# EAGLE design Stabilized-power-supply (EAGLE 7.6.0)
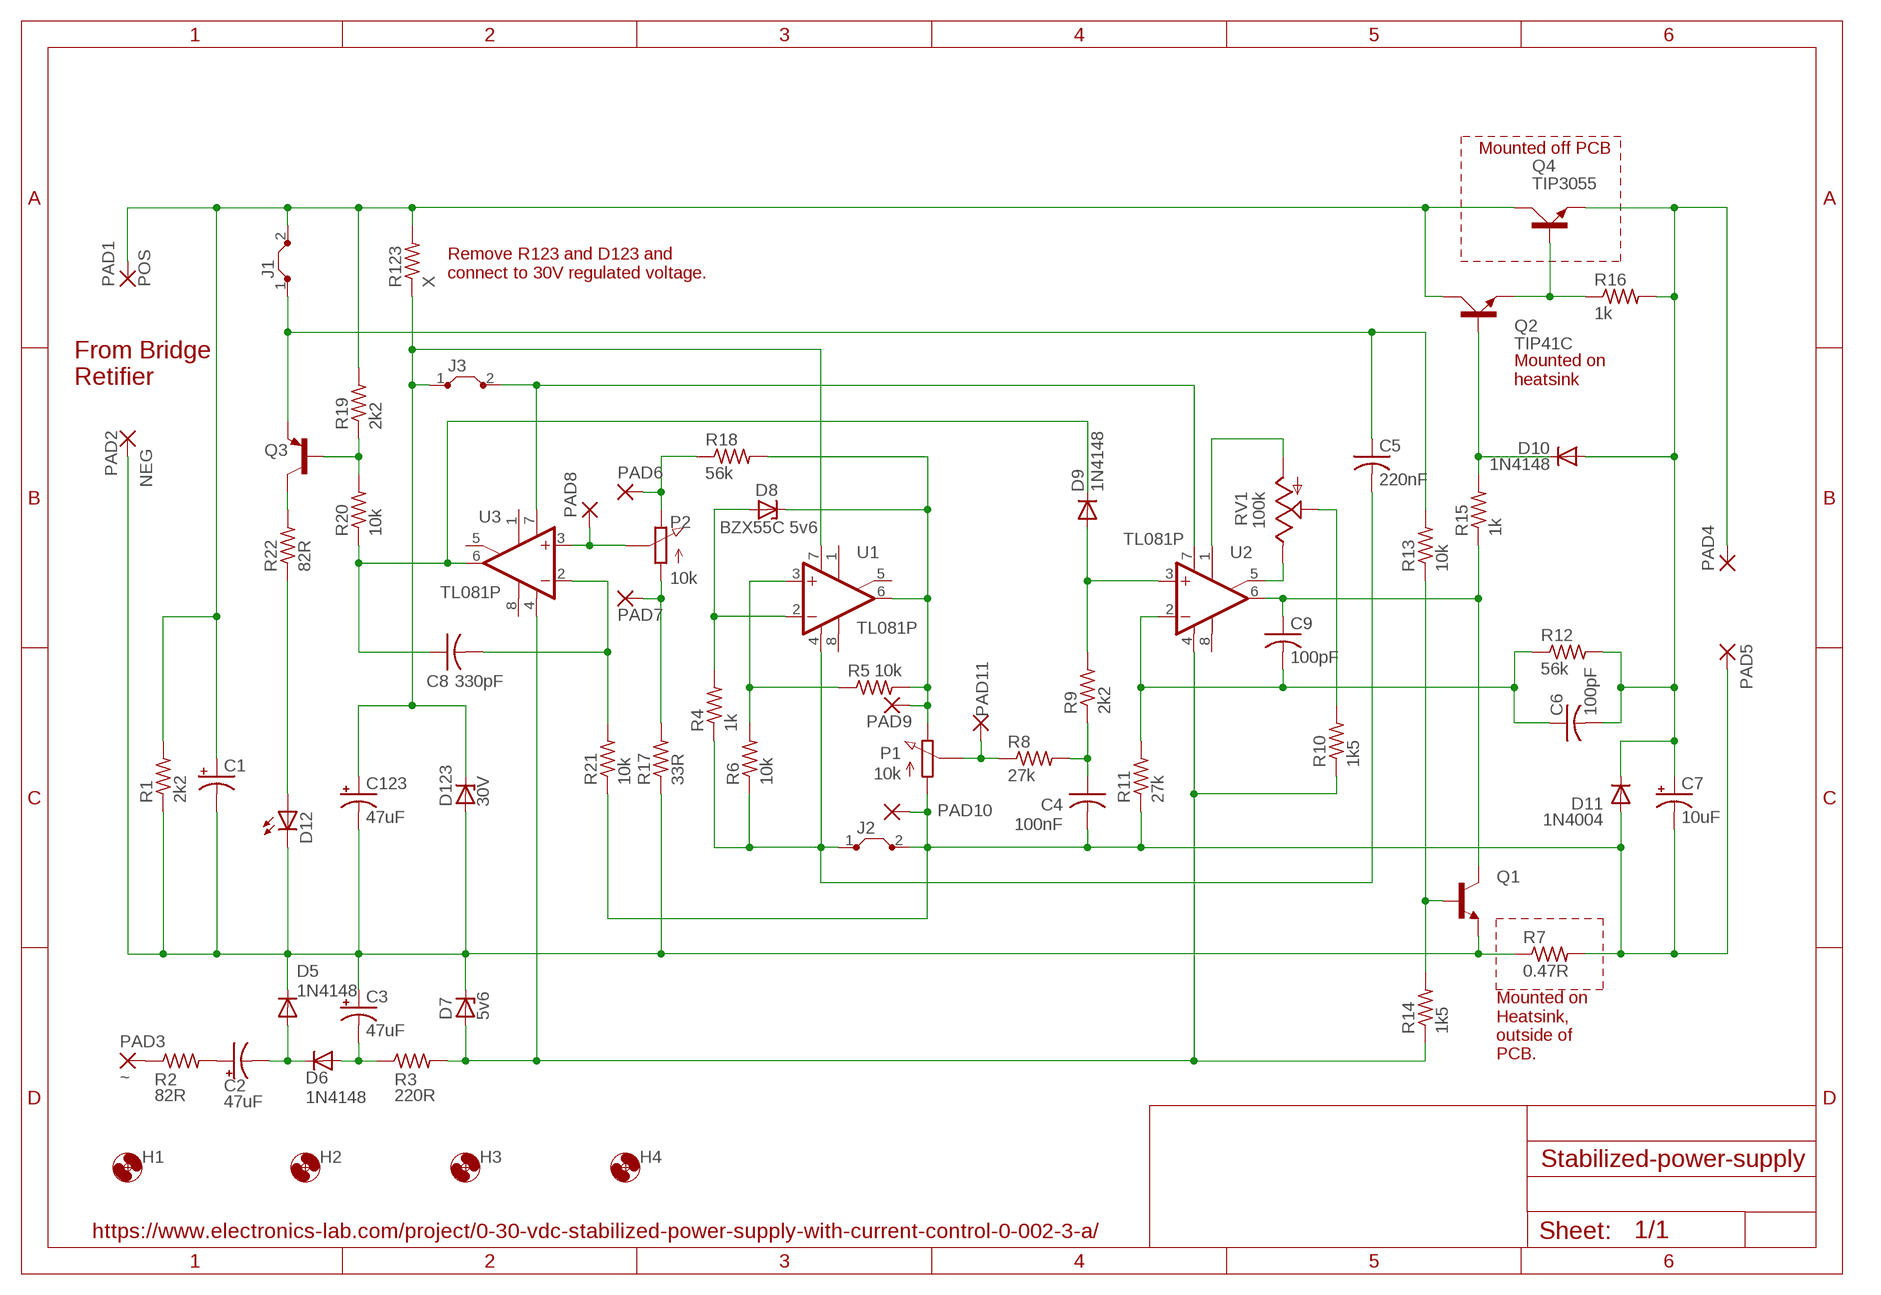
[diagram p0: schematic, sheet 1]

## Parts
C1  CPOL-USE5-10.5  [E5-10,5]
C2  47uF  CPOL-USE2.5-7  [E2,5-7]
C3  47uF  CPOL-USE2.5-7  [E2,5-7]
C4  100nF  C-US075-032X103  [C075-032X103]
C5  220nF  C-US075-032X103  [C075-032X103]
C6  100pF  C-US050-024X044  [C050-024X044]
C7  10uF  CPOL-USE2.5-7  [E2,5-7]
C8  330pF  C-US050-024X044  [C050-024X044]
C9  100pF  C-US050-024X044  [C050-024X044]
C123  47uF  CPOL-USE2.5-7  [E2,5-7]
D5  1N4148  DIODE-D-5  [D-5]
D6  1N4148  DIODE-D-5  [D-5]
D7  5v6  ZENER-DIODEZD-7.5  [ZDIO-7.5]
D8  BZX55C 5v6  ZENER-DIODEZD-7.5  [ZDIO-7.5]
D9  1N4148  DIODE-D-5  [D-5]
D10  1N4148  DIODE-D-5  [D-5]
D11  1N4004  [DO41-10]
D12  LED5MM  [LED5MM]
D123  30V  ZENER-DIODEZD-7.5  [ZDIO-7.5]
H1  MOUNT-HOLE2.8  [2,8]
H2  MOUNT-HOLE2.8  [2,8]
H3  MOUNT-HOLE2.8  [2,8]
H4  MOUNT-HOLE2.8  [2,8]
J1  J7MM  [07]
J2  J7MM  [07]
J3  J7MM  [07]
P1  10k  POT_EXTERNAL  (no package)
P2  10k  POT_EXTERNAL  (no package)
PAD1  POS  3,81/1,4  [3,81/1,4]
PAD2  NEG  3,81/1,4  [3,81/1,4]
PAD3  ~  3,81/1,4  [3,81/1,4]
PAD4  3,81/1,4  [3,81/1,4]
PAD5  3,81/1,4  [3,81/1,4]
PAD6  2,15/1,0  [2,15/1,0]
PAD7  2,15/1,0  [2,15/1,0]
PAD8  2,15/1,0  [2,15/1,0]
PAD9  2,15/1,0  [2,15/1,0]
PAD10  2,15/1,0  [2,15/1,0]
PAD11  2,15/1,0  [2,15/1,0]
Q1  -NPN-TO92-CBE  [TO92-CBE]
Q2  TIP41C  BD139  [TO126AV]
Q3  -PNP-TO92-CBE  [TO92-CBE]
Q4  TIP3055  [TOP3AV]
R1  2k2  R-US_0411/15  [0411/15]
R2  82R  R-US_0207/10  [0207/10]
R3  220R  R-US_0207/10  [0207/10]
R4  1k  R-US_0207/10  [0207/10]
R5  10k  R-US_0207/10  [0207/10]
R6  10k  R-US_0207/10  [0207/10]
R7  0.47R  R-US_0617/22  [0617/22]
R8  27k  R-US_0207/10  [0207/10]
R9  2k2  R-US_0207/10  [0207/10]
R10  1k5  R-US_0207/10  [0207/10]
R11  27k  R-US_0207/10  [0207/10]
R12  56k  R-US_0207/10  [0207/10]
R13  10k  R-US_0207/10  [0207/10]
R14  1k5  R-US_0207/10  [0207/10]
R15  1k  R-US_0207/10  [0207/10]
R16  1k  R-US_0207/10  [0207/10]
R17  33R  R-US_0207/10  [0207/10]
R18  56k  R-US_0207/10  [0207/10]
R19  2k2  R-US_0207/10  [0207/10]
R20  10k  R-US_0207/10  [0207/10]
R21  10k  R-US_0207/10  [0207/10]
R22  82R  R-US_0207/10  [0207/10]
R123  X  R-US_0207/10  [0207/10]
RV1  100k  TRIM_US-ECP10P  [ECP10P]
U1  TL081P  [DIL08]
U2  TL081P  [DIL08]
U3  TL081P  [DIL08]

## Nets
N$1: Q3.C R22.2
N$2: C1.+ J1.2 PAD1.1(P) Q2.C Q4.C R1.2 R19.2 R123.2
N$3: Q3.B R19.1 R20.2
N$4: C8.1 D9.C R20.1 U3.6(OUT)
N$5: P2.S PAD8.1(P) U3.3(+IN)
N$6: P2.E PAD6.1(P) R18.1
N$7: D12.A R22.1
N$8: C123.+ D123.C J3.1 R123.1 U1.7(V+)
N$9: C1.- C3.+ C123.- D5.C D7.C D12.K(C) D123.A PAD2.1(P) Q1.E R1.1 R7.1 R17.1
N$10: C6.2 C7.+ D10.A D11.C PAD4.1(P) Q4.E R12.2 R16.2
N$11: D7.A R3.2 R10.1 R14.1 U2.4(V-) U3.4(V-)
N$12: C8.2 R21.2 U3.2(-IN)
N$13: D8.A R4.2 U1.2(-IN)
N$14: R5.1 R6.2 U1.3(+IN)
N$15: P2.A PAD7.1(P) R17.2
N$16: C4.2 C7.- D11.A J2.2 P1.A PAD5.1(P) PAD10.1(P) R7.2 R11.1 R21.1
N$17: Q1.B R13.1 R14.2
N$18: D8.C P1.E PAD9.1(P) R5.2 R18.2 U1.6(OUT)
N$19: C5.1 J1.1 Q3.E R13.2
N$20: P1.S PAD11.1(P) R8.1
N$21: C4.1 R8.2 R9.1
N$22: D9.A R9.2 U2.3(+IN)
N$23: C6.1 C9.2 R11.2 R12.1 U2.2(-IN)
N$24: D10.C Q2.B R15.2
N$25: C9.1 Q1.C R15.1 U2.6(OUT)
N$26: RV1.A U2.1(ON1)
N$27: RV1.E U2.5(ON2)
N$28: R10.2 RV1.S
N$29: Q2.E Q4.B R16.1
N$30: C3.- D6.A R3.1
N$31: J3.2 U2.7(V+) U3.7(V+)
N$32: C5.2 J2.1 R4.1 R6.1 U1.4(V-)
N$33: C2.- D5.A D6.C
N$34: C2.+ R2.2
N$35: PAD3.1(P) R2.1
Unconnected: U1.1(ON1) U1.5(ON2) U1.8(OPT) U2.8(OPT) U3.1(ON1) U3.5(ON2) U3.8(OPT)

## Notes on the sheet
- Mounted off PCB
- Remove R123 and D123 and
  connect to 30V regulated voltage.
- From Bridge
  Retifier
- Mounted on
  heatsink
- Mounted on
  Heatsink,
  outside of
  PCB.
- https://www.electronics-lab.com/project/0-30-vdc-stabilized-power-supply-with-current-control-0-002-3-a/

## Library data of the parts
C1-C3 C7 C123 = rcl:CPOL-US: POLARIZED CAPACITOR, American symbol
C4-C6 C8 C9 = rcl:C-US: CAPACITOR, American symbol
D5 D6 D9 D10 = diode:DIODE-: DIODE
D7 D8 D123 = diode:ZENER-DIODE: Z-Diode
D11 = diode:1N4004: DIODE general purpose rectifier, 1 A
D12 = led:LED: LED OSRAM: - CHIPLED LG R971, LG N971, LY N971, LG Q971, LY Q971, LO R971, LY R971 LH N974, LH R974 LS Q976, LO Q976, LY Q976 LO Q996 - Hyper CHIPLED LW Q18S LB Q993, LB Q99A, LB R99A - SideLED LS A670, LO A670, LY A670, LG A670, LP A670 LB A673, LV A673, LT A673, LW A673 LH A674 LY A675 LS A676, LA A676, LO A676, LY A676, LW A676 LS A679, LY A679, LG A679 - Hyper Micro SIDELED® LS Y876, LA Y876, LO Y876, LY Y876 LT Y87S - SmartLED LW L88C, LW L88S LB L89C, LB L89S, LG L890 LS L89K, LO L89K, LY L89K LS L896, LA L896, LO L896, LY L896 - TOPLED LS T670, LO T670, LY T670, LG T670, LP T670 LSG T670, LSP T670, LSY T670, LOP T670, LYG T670 LG T671, LOG T671, LSG T671 LB T673, LV T673, LT T673, LW T673 LH T674 LS T676, LA T676, LO T676, LY T676, LB T676, LH T676, LSB T676, LW T676 LB T67C, LV T67C, LT T67C, LS T67K, LO T67K, LY T67K, LW E67C LS E67B, LA E67B, LO E67B, LY E67B, LB E67C, LV E67C, LT E67C LW T67C LS T679, LY T679, LG T679 LS T770, LO T770, LY T770, LG T770, LP T770 LB T773, LV T773, LT T773, LW T773 LH T774 LS E675, LA E675, LY E675, LS T675 LS T776, LA T776, LO T776, LY T776, LB T776 LHGB T686 LT T68C, LB T68C - Hyper Mini TOPLED® LB M676 - Mini TOPLED Santana® LG M470 LS M47K, LO M47K, LY M47K Source: http://www.osram.convergy.de LUXEON: - LUMILED® LXK2-PW12-R00, LXK2-PW12-S00, LXK2-PW14-U00, LXK2-PW14-V00 LXK2-PM12-R00, LXK2-PM12-S00, LXK2-PM14-U00 LXK2-PE12-Q00, LXK2-PE12-R00, LXK2-PE12-S00, LXK2-PE14-T00, LXK2-PE14-U00 LXK2-PB12-K00, LXK2-PB12-L00, LXK2-PB12-M00, LXK2-PB14-N00, LXK2-PB14-P00, LXK2-PB14-Q00 LXK2-PR12-L00, LXK2-PR12-M00, LXK2-PR14-Q00, LXK2-PR14-R00 LXK2-PD12-Q00, LXK2-PD12-R00, LXK2-PD12-S00 LXK2-PH12-R00, LXK2-PH12-S00 LXK2-PL12-P00, LXK2-PL12-Q00, LXK2-PL12-R00 Source: www.luxeon.com KINGBRIGHT: KA-3528ASYC Source: www.kingbright.com
H1-H4 = holes:MOUNT-HOLE: MOUNTING HOLE with drill center marker
J1-J3 = jumper:J: Bridge
P1 P2 = pot_external:POT_EXTERNAL: 16mm Potentiometer one level Source: http://www.alphapotentiometers.net/html/16mm_pot_2.html; _EXTERNAL_: 1
PAD1-PAD5 = wirepad:3,81/1,4: THROUGH-HOLE PAD
PAD6-PAD11 = wirepad:2,15/1,0: THROUGH-HOLE PAD
Q1 = transistor-neu-to92:*-NPN-: NPN Transistror
Q2 = transistor-power:BD139: NPN TRANSISTOR
Q3 = transistor-neu-to92:*-PNP-: PNP Transistror
Q4 = transistor-power:TIP3055: NPN TRANSISTOR
R1-R22 R123 = rcl:R-US_: RESISTOR, American symbol
RV1 = pot:TRIM_US-: POTENTIOMETER
U1-U3 = linear:TL081: OP AMP

## Board
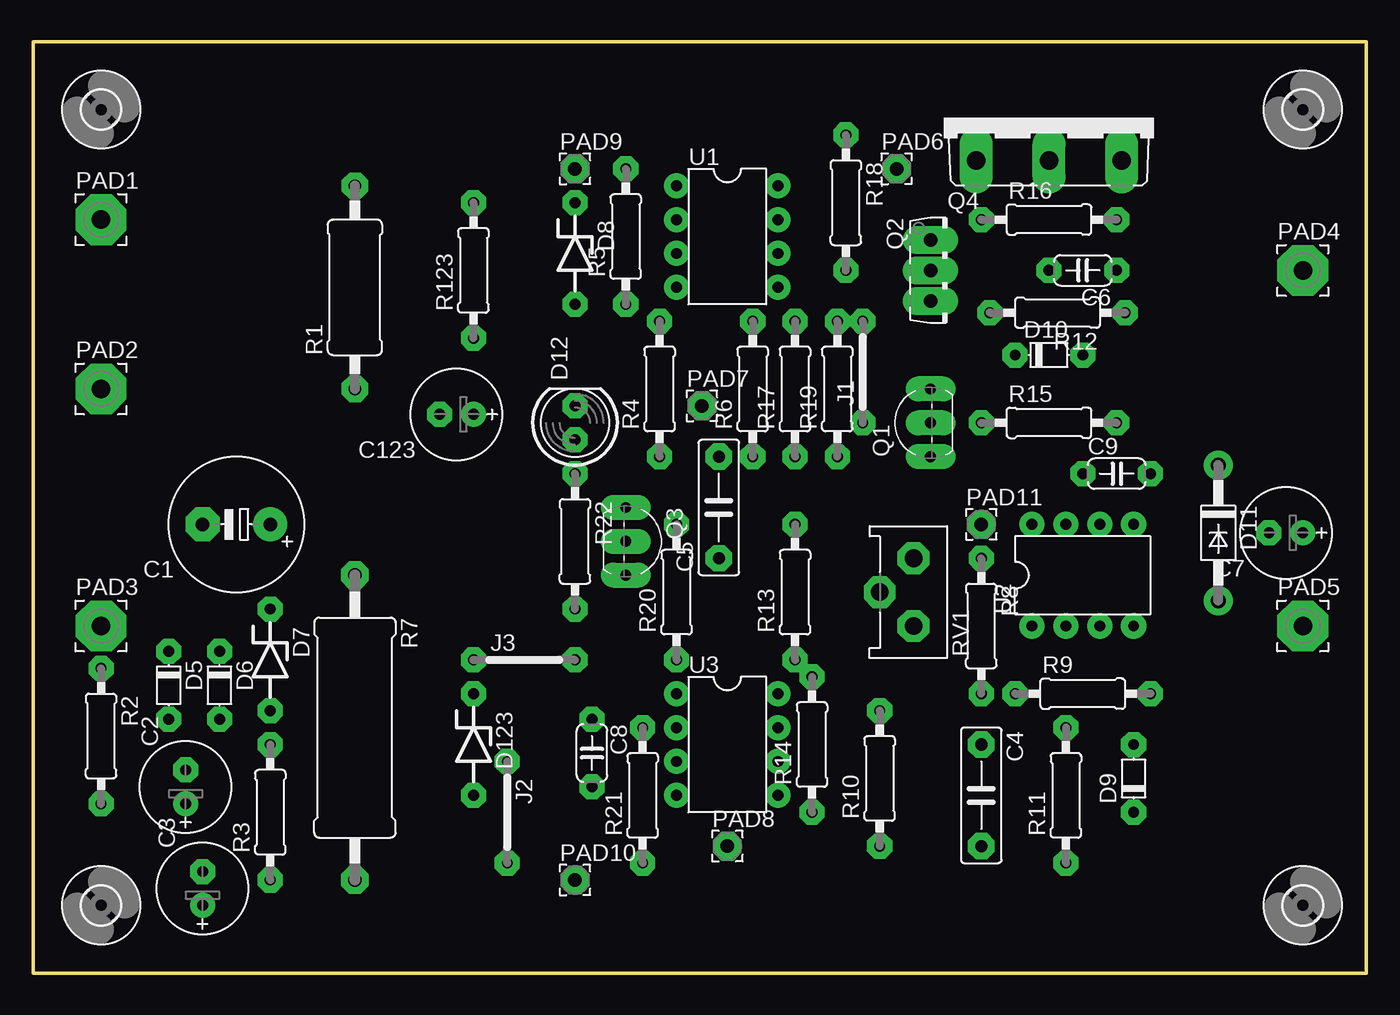
[diagram p1: board, top side]
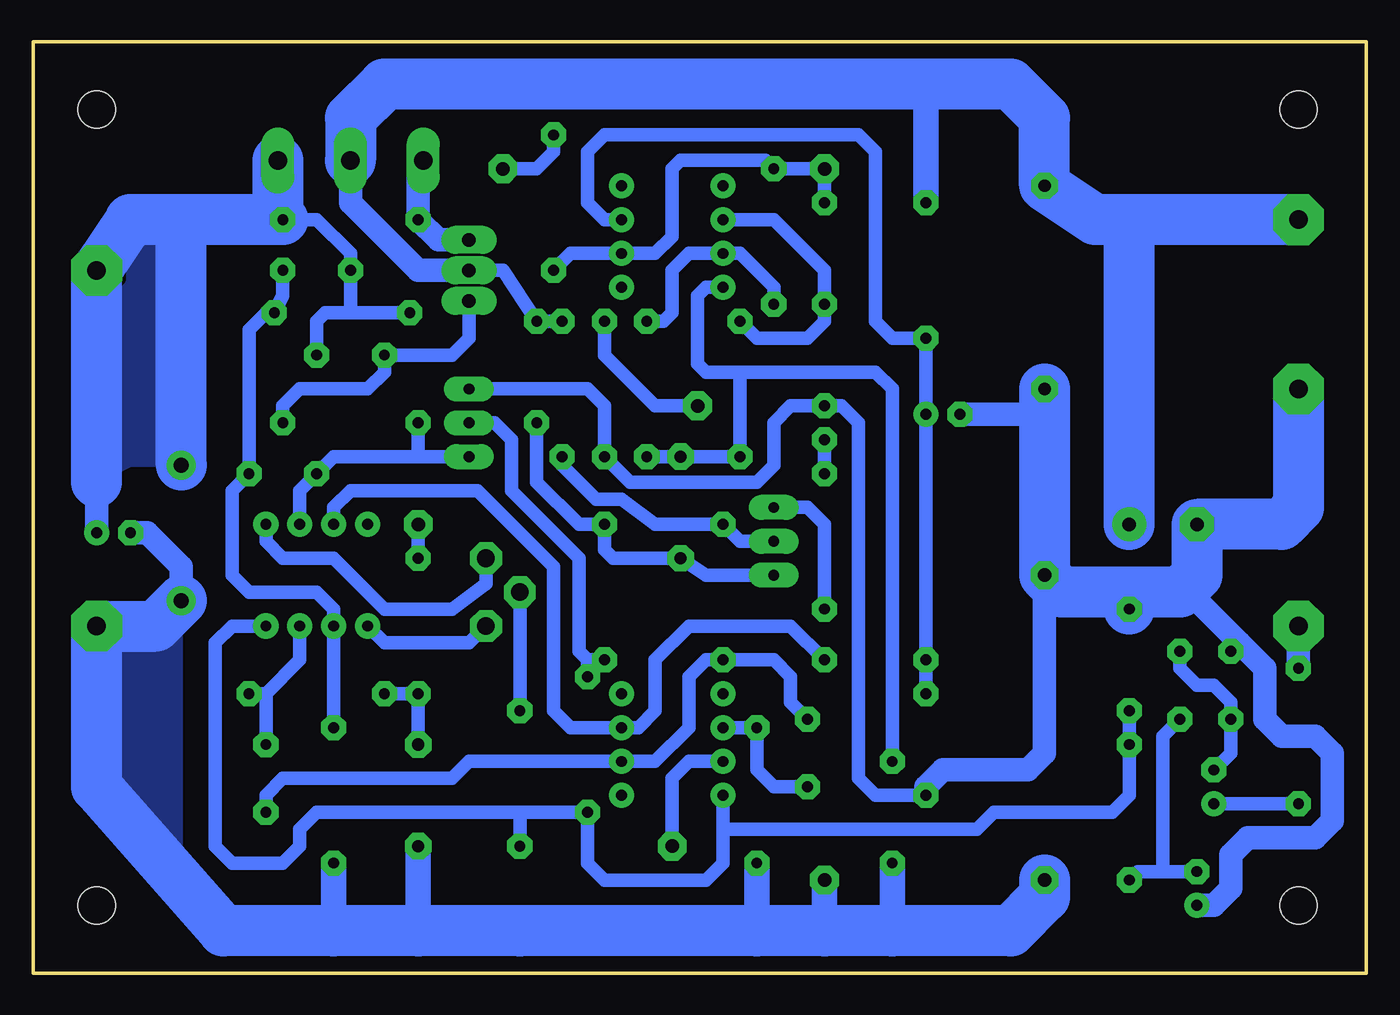
[diagram p2: board, bottom side, seen from below]

Size 100 x 69.85 mm. Coordinates in mm from the lower left corner, seen from the top.
Outline: 0,0 100,0 100,69.85 0,69.85 0,0
Copper layers (1*16): Top 0.035mm / dielectric 1.5mm / Bottom 0.035mm
Design rules "default *": minimum track width 10mil, minimum drill 5mil, track to track 8mil, track to pad 8mil, pad to pad 8mil, via to via 8mil, smd to smd 8mil, copper to edge 40mil, drill to drill 8mil, minimum pad ring 21mil, minimum via ring 8mil, stop-mask expansion 4mil, vias tented up to drill 0mil, thermal gap 10mil

### Footprints (pad centres in the part's own frame; a part is rotated, then mirrored left to right if it is on the bottom)
E5-10,5 = drill 1.016 pad 2.54: + -2.54,0 | drill 1.016 pad 2.54 octagon: - 2.54,0
E2,5-7 = drill 0.813 pad 1.6: + -1.27,0 | drill 0.813 pad 1.6 octagon: - 1.27,0
C075-032X103 = drill 0.914 octagon: 1 -3.81,0; 2 3.81,0
C050-024X044 = drill 0.813 octagon: 1 -2.54,0; 2 2.54,0
D-5 = drill 0.813 octagon: A 2.54,0; C -2.54,0
ZDIO-7.5 = drill 0.813 octagon: A 3.81,0; C -3.81,0
DO41-10 = drill 1.118: A 5.08,0; C -5.08,0
LED5MM = drill 0.813 octagon: A -1.27,0; K 1.27,0
2,8 = hole 2.8: 0,0
07 = drill 0.813 pad 1.6 octagon: 1 -3.81,0; 2 3.81,0
3,81/1,4 = drill 1.397 pad 3.81 octagon: 1 0,0
2,15/1,0 = drill 1.016 pad 2.159 octagon: 1 0,0
TO92-CBE = drill 0.813 long: B 0,0; C -2.54,0; E 2.54,0
TO126AV = drill 1.016 long: B 2.286,-1.27; C 0,-1.27; E -2.286,-1.27
TOP3AV = drill 1.397 long: B -5.461,-3.175; C 0,-3.175; E 5.461,-3.175
0411/15 = drill 0.914 octagon: 1 -7.62,0; 2 7.62,0
0207/10 = drill 0.813 octagon: 1 -5.08,0; 2 5.08,0
0617/22 = drill 1.016 octagon: 1 -11.43,0; 2 11.43,0
ECP10P = drill 1.321 octagon: A -2.54,0; E 2.54,0; S 0,2.54
DIL08 = drill 0.813 pad 1.27: 1 -3.81,-3.81; 2 -1.27,-3.81; 3 1.27,-3.81; 4 3.81,-3.81; 5 3.81,3.81; 6 1.27,3.81; 7 -1.27,3.81; 8 -3.81,3.81

### Placement (x,y rotation side)
C1  15.24,33.66 180 top
C2  11.43,13.97 90 top
C3  12.7,6.35 90 top
C4  71.12,13.34 270 top
C5  51.44,34.92 90 top
C6  78.74,52.7 180 top
C7  93.98,33.02 180 top
C8  41.91,16.51 270 top
C9  81.28,37.47 0 top
C123  31.75,41.91 180 top
D5  10.16,21.59 270 top
D6  13.97,21.59 270 top
D7  17.78,23.5 270 top
D8  40.64,53.98 270 top
D9  82.55,14.61 90 top
D10  76.2,46.35 0 top
D11  88.9,33.02 270 top
D12  40.64,41.27 90 top
D123  33.02,17.14 270 top
H1  5.08,64.77 0 top
H2  95.25,64.77 0 top
H3  5.08,5.08 0 top
H4  95.25,5.08 0 top
J1  62.23,45.09 90 top
J2  35.56,12.06 270 top
J3  36.83,23.5 0 top
PAD1  5.08,56.52 0 top
PAD2  5.08,43.81 0 top
PAD3  5.08,26.04 0 top
PAD4  95.25,52.7 0 top
PAD5  95.25,26.04 0 top
PAD6  64.77,60.33 0 top
PAD7  50.16,42.55 0 top
PAD8  52.07,9.53 0 top
PAD9  40.64,60.33 0 top
PAD10  40.64,6.99 0 top
PAD11  71.12,33.66 0 top
Q1  67.31,41.27 90 top
Q2  68.58,52.7 270 top
Q3  44.45,32.38 270 top
Q4  76.2,64.14 0 top
R1  24.13,51.44 90 top
R2  5.08,17.78 270 top
R3  17.78,12.06 90 top
R4  46.99,43.81 90 top
R5  44.45,55.24 90 top
R6  53.98,43.81 90 top
R7  24.13,18.41 270 top
R8  71.12,26.04 270 top
R9  78.74,20.95 0 top
R10  63.5,14.61 90 top
R11  77.47,13.34 90 top
R12  76.83,49.53 180 top
R13  57.15,28.57 90 top
R14  58.42,17.14 90 top
R15  76.2,41.27 0 top
R16  76.2,56.52 0 top
R17  57.15,43.81 90 top
R18  60.96,57.78 270 top
R19  60.33,43.81 90 top
R20  48.26,28.57 90 top
R21  45.72,13.34 90 top
R22  40.64,32.38 270 top
R123  33.02,52.7 90 top
RV1  66.04,28.57 90 top
U1  52.07,55.24 270 top
U2  78.74,29.84 0 top
U3  52.07,17.14 270 top

### Tracks (layer width: path | path; a pad name or v marks a point on that pad's centre or on a via)
N$1
  Bottom 1.016: R22.2 40.64,33.66 41.91,34.92 Q3.C
N$2
  Bottom 1.016: Q2.C 64.77,52.7 J1.2 R19.2
  Bottom 1.778: Q4.C 76.2,57.78 71.12,52.7 Q2.C
  Bottom 1.93: R123.2 33.02,66.67
  Bottom 3.81: Q4.C 76.2,64.14 73.66,66.67 33.02,66.67 26.67,66.67 24.13,64.14 R1.2 20.32,56.52 17.78,56.52 | PAD1.1 17.78,56.52 | C1.+ 17.78,56.52
N$3
  Bottom 1.016: Q3.B 46.99,32.38 R20.2 53.34,33.66 55.88,35.56 57.78,35.56 60.33,38.1 R19.1
N$4
  Bottom 1.016: D9.C 82.55,13.34 81.28,14.61 68.58,14.61 67.31,15.88 U3.6 53.34,15.88 50.8,18.41 50.8,22.23 49.53,23.5 R20.1 44.45,23.5 43.18,22.23 43.18,20.32 C8.1
N$5
  Bottom 1.016: U3.3 50.8,15.88 52.07,14.61 PAD8.1
N$6
  Bottom 1.016: PAD6.1 62.23,60.33 60.96,61.59 R18.1
N$7
  Bottom 1.016: D12.A R22.1
N$8
  Bottom 1.016: D123.C J3.1 C123.+ R123.1 35.56,47.62 36.83,48.9 36.83,61.59 38.1,62.87 57.15,62.87 58.42,61.59 58.42,57.78 57.15,56.52 U1.7
N$9
  Bottom 1.016: D123.A 36.83,13.34 38.1,14.61 38.1,41.27 39.37,42.55 D12.K 43.18,42.55 44.45,41.27 44.45,38.1 45.72,36.83 55.24,36.83 R17.1 57.15,42.55 58.42,43.81 Q1.E | 11.43,29.21 11.75,29.53 13.02,29.53 | 4.45,34.92 5.08,34.92
  Bottom 1.778: D123.A 33.02,13.97 31.75,15.24 25.4,15.24 24.13,16.51 R7.1 | C3.+ 11.43,5.08 10.16,6.35 10.16,8.89 8.89,10.16 3.81,10.16 2.54,11.43 2.54,16.51 3.81,17.78 6.35,17.78 7.62,19.05 7.62,22.86 9.53,24.77 | C123.- 24.13,41.91 | 9.53,24.77 13.65,28.89 | D5.C 9.53,24.77
  Bottom 3.81: R1.1 24.13,41.91 R7.1 22.86,28.57 17.78,28.57 | PAD2.1 5.08,34.92 6.35,33.66 C1.- 12.7,29.84 13.02,29.53 13.65,28.89 13.97,28.57 17.78,28.57 | D7.C 17.78,28.57
N$10
  Bottom 1.016: 76.2,49.53 78.11,49.53 78.74,48.9 D10.A | 81.66,56.9 R16.2 78.74,56.52 76.2,53.98 C6.2 76.2,49.53 | R12.2 76.2,49.53
  Bottom 1.778: C7.+ 95.25,36.83
  Bottom 3.81: Q4.E 81.66,56.9 | R16.2 88.9,56.52 | 88.9,56.52 92.71,56.52 PAD4.1 95.25,36.83 | D11.C 88.9,56.52
  pour Bottom: 88.9,55.88 93.98,55.88 95.25,54.61 95.25,36.83 92.71,38.1 88.9,38.1
N$11
  Bottom 1.016: U2.4 85.09,26.04 86.36,24.77 86.36,9.53 85.09,8.26 81.28,8.26 80.01,9.53 80.01,10.79 78.74,12.06 63.5,12.06 | 63.5,12.06 R14.1 58.42,8.26 57.15,6.99 49.53,6.99 48.26,8.26 48.26,10.79 | U3.4 48.26,10.79 | D7.A R3.2 17.78,13.34 19.05,12.06 27.94,12.06 29.21,10.79 48.26,10.79 | R10.1 63.5,12.06
N$12
  Bottom 1.016: C8.2 43.18,13.97 44.45,13.97 45.72,15.24 R21.2 U3.2
N$13
  Bottom 1.016: R4.2 45.72,47.62 41.91,47.62 40.64,48.9 D8.A 40.64,52.7 44.45,56.52 U1.2
N$14
  Bottom 1.016: R5.1 44.45,51.44 46.99,53.98 U1.3 50.8,53.98 52.07,52.7 52.07,49.53 52.7,48.9 R6.2
N$15
  Bottom 1.016: PAD7.1 53.34,42.55 57.15,46.35 R17.2
N$16
  Bottom 1.778: C7.- 91.44,33.02 88.9,30.48 D11.A
  Bottom 1.93: C4.2 71.12,3.17 | R11.1 77.47,3.17 | R21.1 45.72,3.17 | J2.2 35.56,3.17 | PAD10.1 40.64,3.17
  Bottom 3.81: R7.2 24.13,5.71 26.67,3.17 35.56,3.17 40.64,3.17 45.72,3.17 63.5,3.17 71.12,3.17 77.47,3.17 85.72,3.17 95.25,13.97 PAD5.1 90.81,26.04 D11.A
  pour Bottom: 95.25,25.4 95.25,13.97 88.9,7.62 88.9,27.94 90.17,26.67 93.98,26.67
N$17
  Bottom 1.016: Q1.B 65.41,41.27 64.14,40.01 64.14,36.2 59.05,31.11 59.05,24.13 58.42,23.5 | 58.42,23.5 R13.1 | R14.2 58.42,23.5
N$18
  Bottom 1.016: D8.C PAD9.1 R5.2 45.09,60.96 51.44,60.96 52.07,60.33 52.07,55.24 53.34,53.98 U1.6 59.69,53.98 R18.2
N$19
  Bottom 1.016: Q3.E 49.53,29.84 C5.1 56.52,31.11 57.15,31.75 R13.2 59.05,33.66 62.23,36.83 J1.1
N$20
  Bottom 1.016: PAD11.1 R8.1
N$21
  Bottom 1.016: R9.1 R8.2 C4.1
N$22
  Bottom 1.016: U2.3 80.01,23.5 82.55,20.95 | 82.55,20.95 R9.2 | D9.A 82.55,20.95
N$23
  Bottom 1.016: R11.2 U2.2 77.47,27.3 78.74,28.57 83.82,28.57 85.09,29.84 85.09,36.2 C9.2 83.82,48.26 82.55,49.53 R12.1 81.28,50.8 C6.1
N$24
  Bottom 1.016: Q2.B 67.31,47.62 68.58,46.35 D10.C 73.66,45.09 74.93,43.81 80.01,43.81 81.28,42.55 R15.2
N$25
  Bottom 1.016: U2.6 80.01,36.2 C9.1 77.47,38.73 71.12,38.73 | Q1.C 71.12,38.73 | R15.1 71.12,38.73
N$26
  Bottom 1.016: U2.1 73.66,24.77 67.31,24.77 RV1.A
N$27
  Bottom 1.016: RV1.E 66.04,29.21 68.58,27.3 73.66,27.3 77.47,31.11 81.28,31.11 82.55,32.38 U2.5
N$28
  Bottom 1.016: RV1.S R10.2
N$29
  Bottom 1.778: Q4.B 71.12,61.85 R16.1 69.6,54.99 Q2.E
N$30
  Bottom 1.016: R3.1 17.14,7.62 15.24,7.62 | 15.24,7.62 C3.- | D6.A 15.24,17.78 15.24,7.62
N$31
  Bottom 1.016: U2.7 77.47,34.92 76.2,36.2 66.67,36.2 60.96,30.48 60.96,19.68 59.69,18.41 U3.7 54.61,18.41 53.34,19.68 53.34,23.5 50.8,26.04 43.18,26.04 J3.2
N$32
  Bottom 1.016: R6.1 C5.2 R4.1 46.99,45.09 | U1.4 49.53,51.44 50.16,50.8 50.16,45.72 49.53,45.09 46.99,45.09 | 46.99,45.09 36.83,45.09 35.56,43.81 J2.1
N$33
  Bottom 1.016: C2.- 10.16,16.51 D5.A 10.16,20.32 11.43,21.59 12.7,21.59 13.97,22.86 D6.C
N$34
  Bottom 1.016: R2.2 C2.+
N$35
  Bottom 1.778: R2.1 PAD3.1